# Altium schematic sheet 03_MCU.SchDoc: ECE315 MCU
size A; Date: 4/25/2017; ApprovedBy: JSK; CheckedBy: JSK; Author: JSK; CompanyName: University of Wisconsin; DrawnBy: JSK; Engineer: JSK; Organization: ECE 315; Address1: College of Engineering; Address2: 1415 Engineering Drive; Address3: Madison, WI 53706; Address4: ECE 315 Fall 2017; Revision: A; SheetNumber: 3; SheetTotal: 6; AssemblyNumber: ECE315-F19; ApprovedDate: 04/02/2019
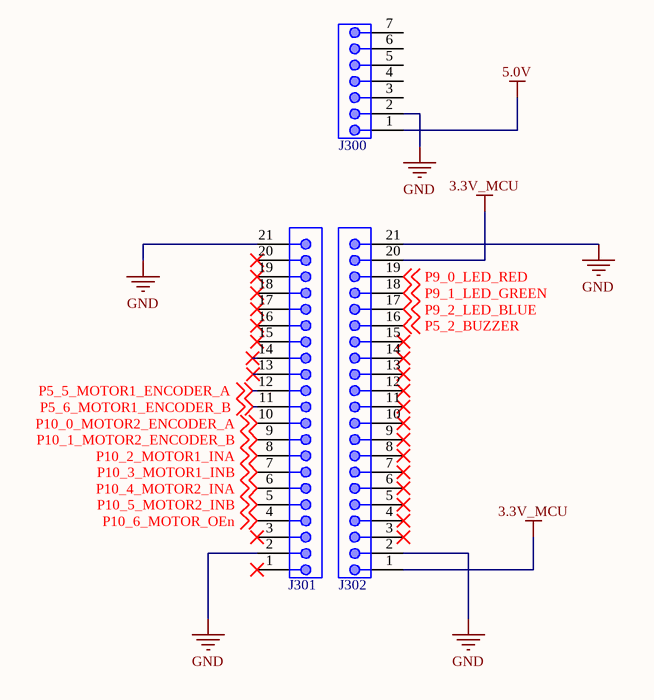
[diagram p0: 03_MCU.SchDoc]

## Parts
J300  CONN_HEADER_MALE_1x7  [HDR1X7_Stagger]  (value not drawn)
J301  CONN_HEADER_MALE_1x21  [HDR1X21 _Stagger]  (value not drawn)
J302  CONN_HEADER_MALE_1x21  [HDR1X21 _Stagger]  (value not drawn)

## Nets
3.3V_MCU: J302.1 J302.20
5.0V: J300.1
GND: J300.2 J301.2 J301.21 J302.2 J302.21
P5_2_BUZZER: J302.16 ; off-sheet P5_2_BUZZER
P5_5_MOTOR1_ENCODER_A: J301.12 ; off-sheet P5_5_MOTOR1_ENCODER_A
P5_6_MOTOR1_ENCODER_B: J301.11 ; off-sheet P5_6_MOTOR1_ENCODER_B
P9_0_LED_RED: J302.19 ; off-sheet P9_0_LED_RED
P9_1_LED_GREEN: J302.18 ; off-sheet P9_1_LED_GREEN
P9_2_LED_BLUE: J302.17 ; off-sheet P9_2_LED_BLUE
P10_0_MOTOR2_ENCODER_A: J301.10 ; off-sheet P10_0_MOTOR2_ENCODER_A
P10_1_MOTOR2_ENCODER_B: J301.9 ; off-sheet P10_1_MOTOR2_ENCODER_B
P10_2_MOTOR1_INA: J301.8 ; off-sheet P10_2_MOTOR1_INA
P10_3_MOTOR1_INB: J301.7 ; off-sheet P10_3_MOTOR1_INB
P10_4_MOTOR2_INA: J301.6 ; off-sheet P10_4_MOTOR2_INA
P10_5_MOTOR2_INB: J301.5 ; off-sheet P10_5_MOTOR2_INB
P10_6_MOTOR_OEn: J301.4 ; off-sheet P10_6_MOTOR_OEn

Not connected (* = marked no-connect by the designer): J300 3 4 5 6 7; J301 1* 3* 13* 14* 15* 16* 17* 18* 19* 20*; J302 3* 4* 5* 6* 7* 8* 9* 10* 11* 12* 13* 14* 15*

## Library data of the parts
J300 = CONN_HEADER_MALE_1x7: Header, 7-Pin; ComponentLink1URL: http://www.farnell.com/cad/1737268.pdf; ComponentLink1Description: http://www.farnell.com/cad/1737268.pdf; ComponentLink2URL: http://katalog.we-online.de/em/datasheet/6130xx11121.pdf; ComponentLink2Description: http://katalog.we-online.de/em/datasheet/6130xx11121.pdf; ComponentLink3URL: https://datasheet.ciiva.com/741/xrxczzzsxxn-rc-st-11635-b-741840.pdf?src-supplier=Digi-Key; ComponentLink3Description: https://datasheet.ciiva.com/741/xrxczzzsxxn-rc-st-11635-b-741840.pdf?src-supplier=Digi-Key
J301 J302 = CONN_HEADER_MALE_1x21: Header, 21-Pin; ComponentLink1URL: http://www.farnell.com/cad/1737268.pdf; ComponentLink1Description: http://www.farnell.com/cad/1737268.pdf; ComponentLink2URL: http://katalog.we-online.de/em/datasheet/6130xx11121.pdf; ComponentLink2Description: http://katalog.we-online.de/em/datasheet/6130xx11121.pdf; ComponentLink3URL: https://datasheet.ciiva.com/741/xrxczzzsxxn-rc-st-11635-b-741840.pdf?src-supplier=Digi-Key; ComponentLink3Description: https://datasheet.ciiva.com/741/xrxczzzsxxn-rc-st-11635-b-741840.pdf?src-supplier=Digi-Key